# EasyEDA Pro project ProPrj_3x3motorFPGA_2025-06-10.epro, schematic FPGA
Create Date: 2025-06-04; Page Name: P1; Project Name: 3x3motorFPGA; Schematic Name: FPGA; Update Date: 2025-06-10; Company: EasyEDA.com; Page Size: A4; Version: V1.0
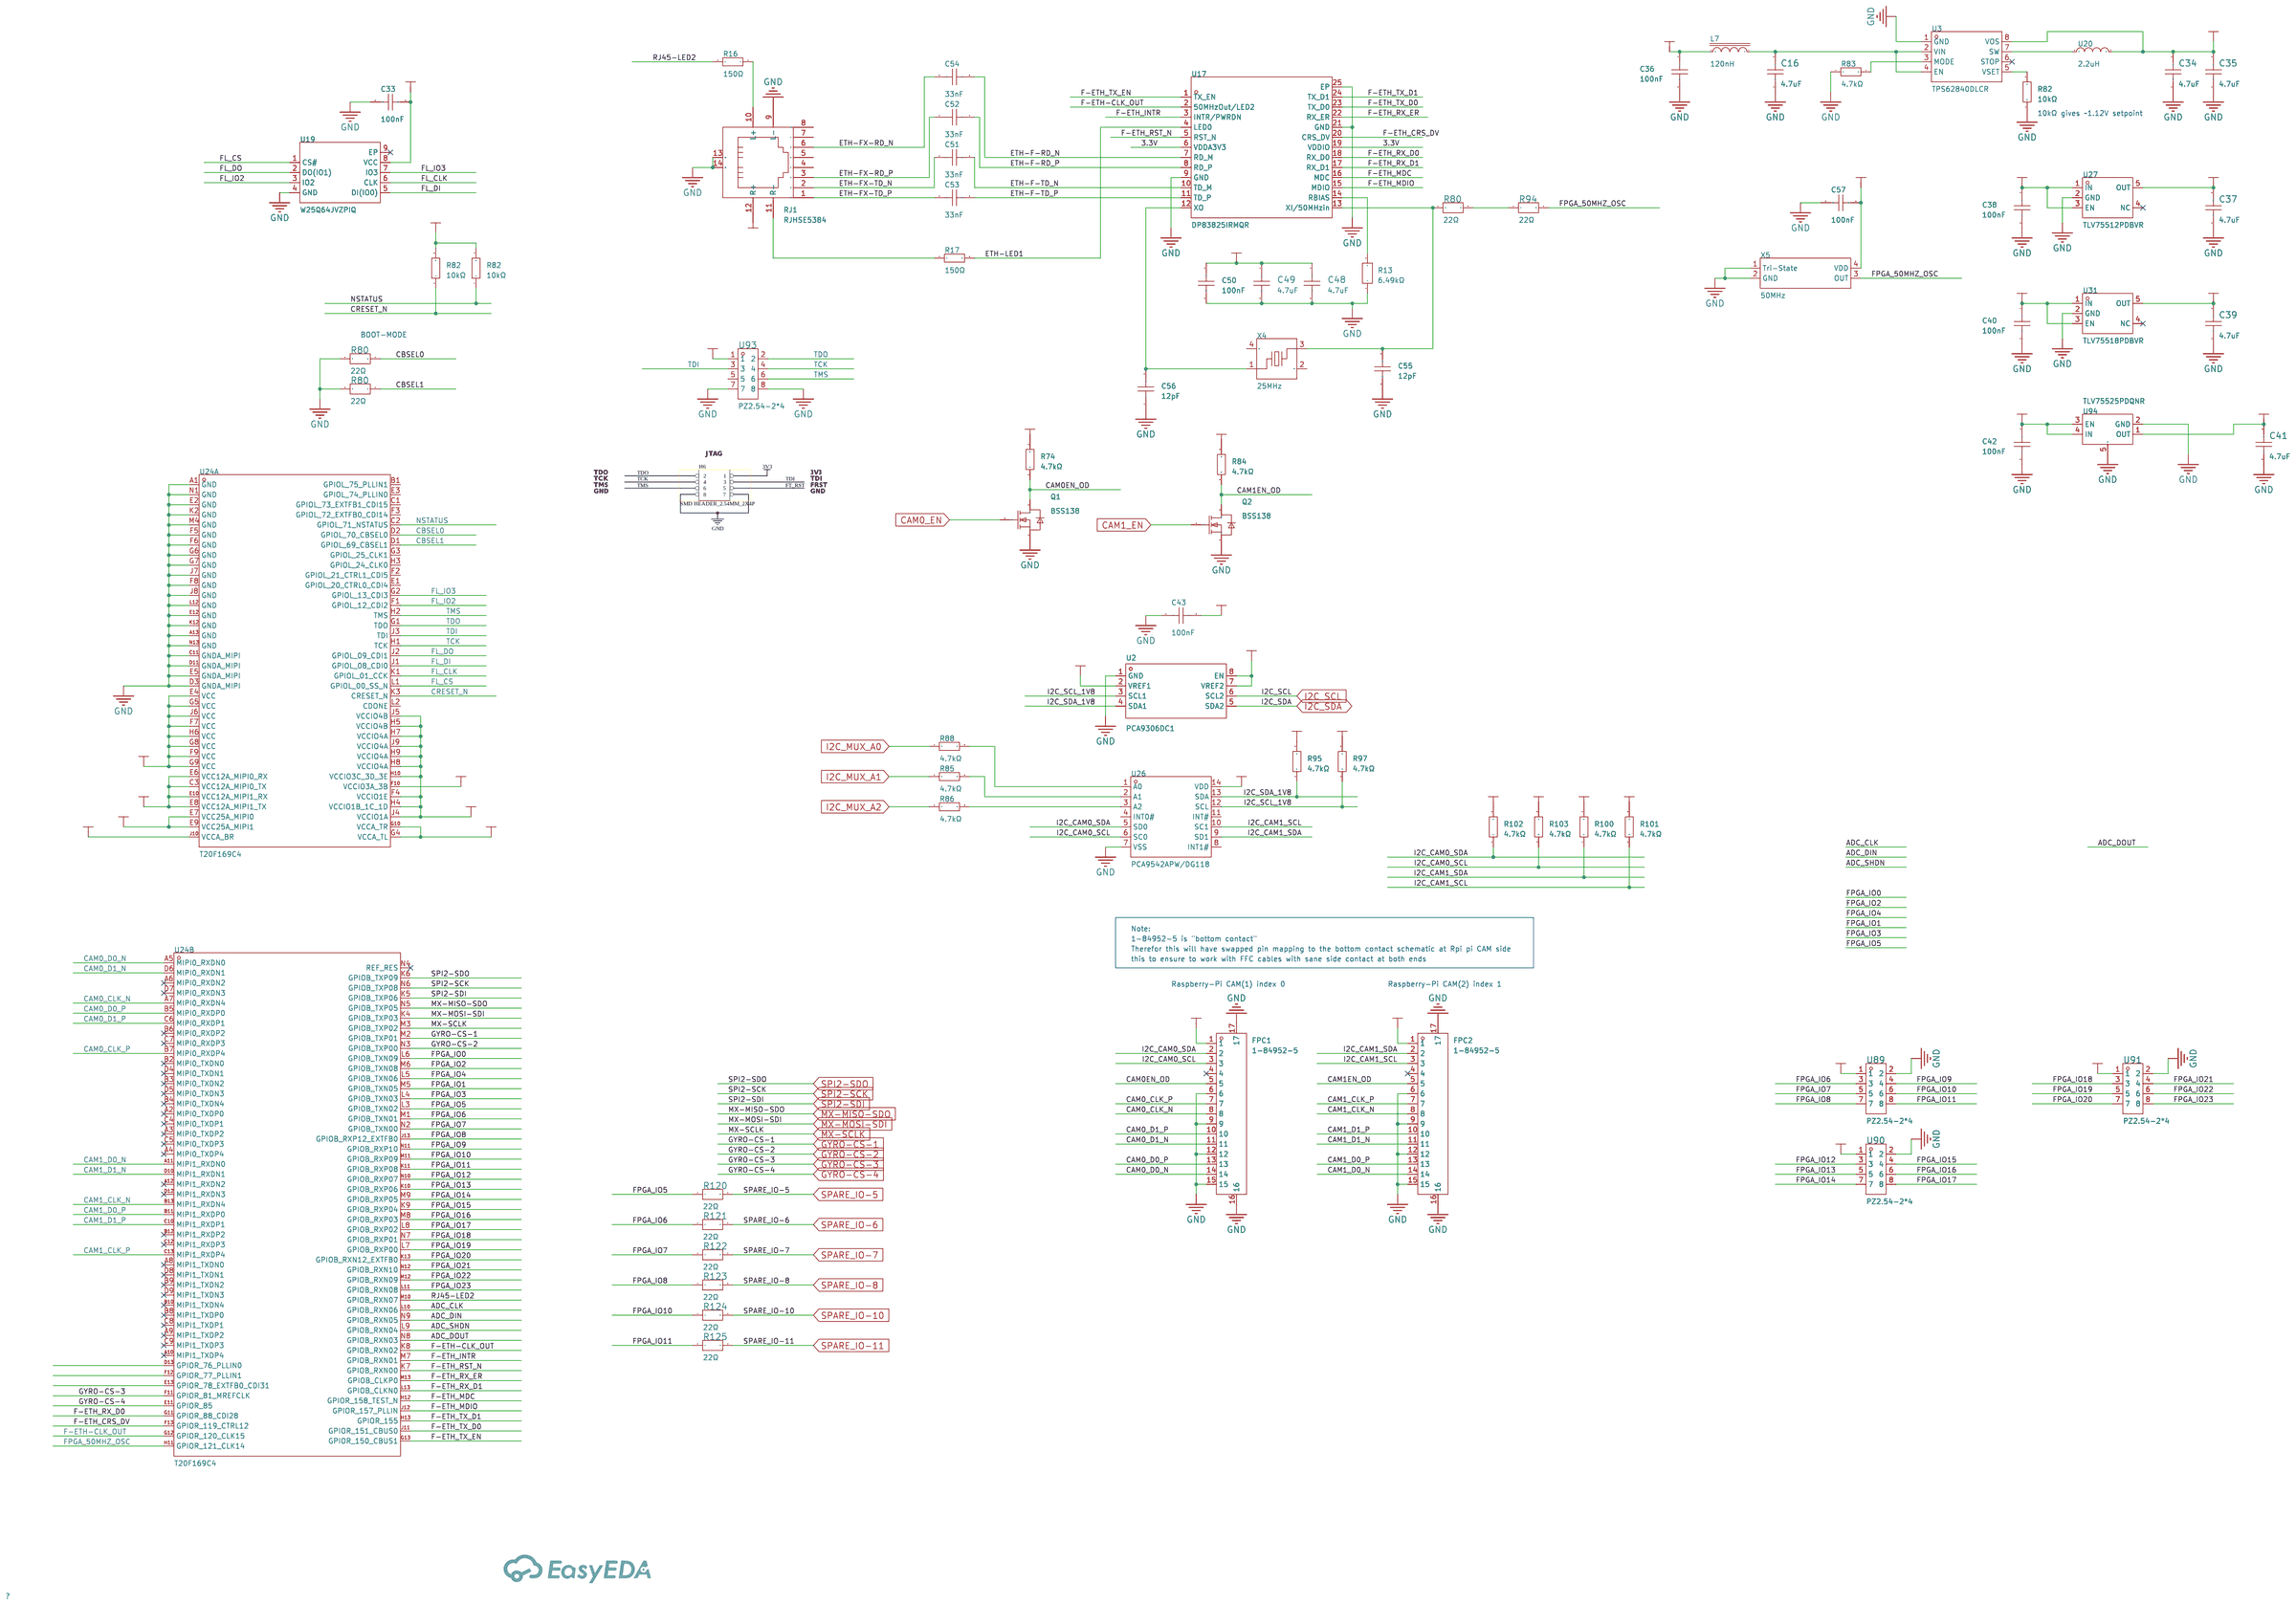
[diagram p3: schematic sheet]

## Parts
C16  4.7uF  [C0402]
C33  100nF  [C0402]
C34  4.7uF  [C0402]
C35  4.7uF  [C0402]
C36  100nF  [C0402]
C37  4.7uF  [C0402]
C38  100nF  [C0402]
C39  4.7uF  [C0402]
C40  100nF  [C0402]
C41  4.7uF  [C0402]
C42  100nF  [C0402]
C43  100nF  [C0402]
C48  4.7uF  [C0402]
C49  4.7uF  [C0402]
C50  100nF  [C0402]
C51  33nF  [C0402]
C52  33nF  [C0402]
C53  33nF  [C0402]
C54  33nF  [C0402]
C55  12pF  [C0402]
C56  12pF  [C0402]
C57  100nF  [C0402]
CBB1  -
FPC1  1-84952-5  [FPC-SMD_15P-P1.00_TE_1-84952-5]
FPC2  1-84952-5  [FPC-SMD_15P-P1.00_TE_1-84952-5]
L7  120nH  [IND-SMD_L2.9-W2.5]
Q1  BSS138  [SOT-23-3_L2.9-W1.3-P1.90-LS2.4-BR-1]
Q2  BSS138  [SOT-23-3_L2.9-W1.3-P1.90-LS2.4-BR-1]
R13  6.49kΩ  [R0402]
R16  150Ω  [R0402]
R17  150Ω  [R0402]
R74  4.7kΩ  [R0402]
R80  22Ω  [R0402]  (no BOM)
R80#2  22Ω  [R0402]
R80#3  22Ω  [R0402]
R82  10kΩ  [R0402]
R82#2  10kΩ  [R0402]
R82#3  10kΩ  [R0402]
R83  4.7kΩ  [R0402]
R84  4.7kΩ  [R0402]
R85  4.7kΩ  [R0402]
R86  4.7kΩ  [R0402]
R88  4.7kΩ  [R0402]
R94  22Ω  [R0402]  (no BOM)
R95  4.7kΩ  [R0402]
R97  4.7kΩ  [R0402]
R100  4.7kΩ  [R0402]
R101  4.7kΩ  [R0402]
R102  4.7kΩ  [R0402]
R103  4.7kΩ  [R0402]
R120  22Ω  [R0402]
R121  22Ω  [R0402]
R122  22Ω  [R0402]
R123  22Ω  [R0402]
R124  22Ω  [R0402]
R125  22Ω  [R0402]
RJ1  RJHSE5384  [RJ45-TH_RJHSE5384]
U2  PCA9306DC1  [VSSOP-8_L2.4-W2.1-P0.50-LS3.2-BR]
U3  TPS62840DLCR  [VSON-8_L2.0-W1.5-P0.50-BL]
U17  DP83825IRMQR  [HVQFN-24_L3.0-W3.0-P0.40-TL-EP1.9]
U19  W25Q64JVZPIQ  [WSON-8_L6.0-W5.0-P1.27-BL-EP]
U20  2.2uH  [IND-SMD_L4.7-W4.2]
U24  T20F169C4  [FBGA-169_L9.0-W9.0-R13-C13-P0.65-TL]  (sections 1,2)
U26  PCA9542APW/DG118  [TSSOP-14_L4.9-W4.4-P0.65-LS6.4-BL]
U27  TLV75512PDBVR  [SOT-23-5_L2.9-W1.6-P0.95-LS2.8-BR]
U31  TLV75518PDBVR  [SOT-23-5_L2.9-W1.6-P0.95-LS2.8-BR]
U89  PZ2.54-2*4  [HDR-TH_8P-P2.54-V-M-R2-C4-S2.54]
U90  PZ2.54-2*4  [HDR-TH_8P-P2.54-V-M-R2-C4-S2.54]
U91  PZ2.54-2*4  [HDR-TH_8P-P2.54-V-M-R2-C4-S2.54]
U93  PZ2.54-2*4  [HDR-TH_8P-P2.54-V-M-R2-C4-S2.54]
U94  TLV75525PDQNR  [X2SON-4_L1.0-W1.0-P0.65-TL-EP]
X4  25MHz  [CRYSTAL-SMD_4P-L5.0-W3.2-BL]
X5  50MHz  [OSC-SMD_4P-L3.2-W2.5-BL-OXETDLJANF-0.032768MHZ]

## Library data of the parts
C16 C34 C35 C37 C39 C41 C48 C49 = LMK105BBJ475MVLF: Capacitance: Tolerance:±20% Tolerance:±20% Voltage Rated: Temperature Coefficient:; LCSC Part Name: 4.7uF ±20% 10V; Supplier Part: C386043; Manufacturer: TAIYO YUDEN(太诱); Supplier Footprint: 0402; JLCPCB Part Class: Extended Part; Datasheet: https://atta.szlcsc.com/upload/public/pdf/source/20210525/C2802164_C0429B055888A674C3F00BA74B841C5B.pdf; Supplier: LCSC; Tolerance: ±20%; Check: true
C33 C36 C38 C40 C42 C43 C50 C57 = CL05B104KB54PNC: Capacitance: Tolerance:±10% Tolerance:±10% Voltage Rated: Temperature Coefficient:; LCSC Part Name: 100nF ±10% 50V; Supplier Part: C307331; Manufacturer: SAMSUNG(三星); Supplier Footprint: 0402; JLCPCB Part Class: Basic Part; Datasheet: https://atta.szlcsc.com/upload/public/pdf/source/20160218/1457707763339.pdf; Supplier: LCSC; Tolerance: ±10%; Check: true
C51-C54 = 0402B333K160CT: Capacitance: Tolerance:±10% Tolerance:±10% Voltage Rated: Temperature Coefficient:; LCSC Part Name: 33nF ±10% 16V; Supplier Part: C301939; Manufacturer: Walsin(华新科); Supplier Footprint: 0402; JLCPCB Part Class: Extended Part; Datasheet: https://atta.szlcsc.com/upload/public/pdf/source/20191217/C469650_84AD5C6F618CF4AC0C6D987F2E8FE6F8.pdf; Supplier: LCSC; Tolerance: ±10%; Check: true
C55 C56 = V120J0402HQC500NBT: Capacitance:12pF Voltage Rating:50V Temperature Coefficient:C0G; LCSC Part Name: ±5pF 12pF 50V; Supplier Part: C5251212; Manufacturer: VIIYONG(微容); Supplier Footprint: 0402; JLCPCB Part Class: Extended Part; Datasheet: https://atta.szlcsc.com/upload/public/pdf/source/20210621/C2841456_D184B2C3CE76695828CADF567D00C122.pdf; Supplier: LCSC; Voltage Rating: 50V; Temperature Coefficient: C0G; Check: true
FPC1 FPC2 = 1-84952-5_C3170098: Locking Feature:Drawer Type Contact Type:Bottom Contact Number of Contacts:15P Pitch:1mm Mounting Type:Horizontal attachment FFC, FCB Thickness:0.3mm FFC, FCB Thickness:0.3mm Height Above Board:2.56mm Contact Material:Phosphor Bronze Contact Plating:Tin O; LCSC Part Name: 间距:1mm P数:15P 抽屉式 下接; Supplier Part: C3170098; Manufacturer: TE Connectivity(泰科电子); Supplier Footprint: SMD,P=1mm,卧贴; JLCPCB Part Class: Extended Part; Datasheet: https://atta.szlcsc.com/upload/public/pdf/source/20241023/74E0AF1B1DB8D7A45038BB5AC79B3184.pdf; Supplier: LCSC; Locking Feature: Drawer Type; Contact Type: Bottom Contact; Number of Contacts: 15P; Pitch: 1mm; Mounting Type: Horizontal attachment; FFC, FCB Thickness: 0.3mm; Height Above Board: 2.56mm; Contact Material: Phosphor Bronze; Contact Plating: Tin; Operating Temperature Range: -40℃~+85℃
L7 = LSF1008-R12J-T: Inductance: Tolerance:±5% Tolerance:±5% Rated Current: DC Resistance (DCR):; LCSC Part Name: 120nH ±5%; Supplier Part: C252036; Manufacturer: EMTEK(兆欣); Supplier Footprint: 1008; JLCPCB Part Class: Extended Part; Datasheet: https://atta.szlcsc.com/upload/public/pdf/source/20180820/C252039_93C7C0847C63F47FE7E3FF4F1F6863C7.pdf; Supplier: LCSC; Tolerance: ±5%
Q1 Q2 = BSS138: Type:1 N-channel Drain Source Voltage (Vdss): Continuous Drain Current (Id): Drain Source On Resistance (RDS(on)@Vgs,Id):3.5Ω@4.5V,220mA Power Dissipation (Pd): Gate Threshold Voltage (Vgs(th)@Id):1.6V@1mA Total Gate Charge (Qg@Vgs):- Input Capacitance (C; LCSC Part Name: N沟道,电流:220mA,耐压:50V; Supplier Part: C3015220; Manufacturer: KUU; Supplier Footprint: SOT-23; JLCPCB Part Class: Extended Part; Datasheet: https://atta.szlcsc.com/upload/public/pdf/source/20220516/125DEF07DB3AB32C02C9AD402DEFFF8E.pdf; Supplier: LCSC; Type: 1 N-channel; Drain Source On Resistance (RDS(on)@Vgs,Id): 3.5Ω@4.5V,220mA; Gate Threshold Voltage (Vgs(th)@Id): 1.6V@1mA; Input Capacitance (Ciss@Vds): 50pF@25V; Operating Temperature: -55℃~+150℃
R13 = RT0402BRE076K49L: Type:Thin Film Resistor Resistance: Tolerance:±0.1% Tolerance:±0.1% Power(Watts): Temperature Coefficient:±50ppm/℃ Temperature Coefficient:±50ppm/℃ Operating Temperature Range:-55℃~+155℃ Operating Temperature Range:-55℃~+155℃; LCSC Part Name: 薄膜电阻 6.49kΩ ±0.1% 62.5mW; Supplier Part: C853380; Manufacturer: YAGEO(国巨); Supplier Footprint: 0402; JLCPCB Part Class: Extended Part; Datasheet: https://atta.szlcsc.com/upload/public/pdf/source/20200610/C326738_5639A9F1B6EB6E4AE2197577D3456E7F.pdf; Supplier: LCSC; Type: Thin Film Resistor; Tolerance: ±0.1%; Temperature Coefficient: ±50ppm/℃; Operating Temperature Range: -55℃~+155℃; Check: true
R16 R17 = 0402WGF1500TCE: Type:Thick Film Resistors Resistance: Tolerance:±1% Tolerance:±1% Power(Watts): Overload Voltage (Max): Temperature Coefficient:±100ppm/℃ Temperature Coefficient:±100ppm/℃ Operating Temperature Range:-55℃~+155℃ Operating Temperature Range:-55℃~+155℃; LCSC Part Name: 150Ω ±1% 62.5mW 厚膜电阻; Supplier Part: C25082; Manufacturer: UNI-ROYAL(厚声); Supplier Footprint: 0402; JLCPCB Part Class: Extended Part; Datasheet: https://atta.szlcsc.com/upload/public/pdf/source/20200306/C422600_1E6D84923E4A46A82E41ADD87F860B5C.pdf; Supplier: LCSC; Type: Thick Film Resistors; Tolerance: ±1%; Temperature Coefficient: ±100ppm/℃; Operating Temperature Range: -55℃~+155℃; Check: true
R74 R83-R86 R88 R95 R97 R100-R103 = 0402WGF4701TCE: Type:Thick Film Resistors Resistance:4.7kΩ Tolerance:±1% Tolerance:±1% Power(Watts): Overload Voltage (Max): Temperature Coefficient:±100ppm/℃ Temperature Coefficient:±100ppm/℃ Operating Temperature Range:-55℃~+155℃ Operating Temperature Range:-55℃~+155℃; LCSC Part Name: 4.7kΩ ±1% 62.5mW 厚膜电阻; Supplier Part: C25900; Manufacturer: UNI-ROYAL(厚声); Supplier Footprint: 0402; JLCPCB Part Class: Basic Part; Datasheet: https://atta.szlcsc.com/upload/public/pdf/source/20200306/C422600_1E6D84923E4A46A82E41ADD87F860B5C.pdf; Supplier: LCSC; Type: Thick Film Resistors; Tolerance: ±1%; Temperature Coefficient: ±100ppm/℃; Operating Temperature Range: -55℃~+155℃
R80 R80#2 R80#3 R94 R120-R125 = ERJU02J220X: Type:Thick Film Resistors Resistance: Tolerance:±5% Tolerance:±5% Power(Watts): Overload Voltage (Max):- Temperature Coefficient:±200ppm/℃ Temperature Coefficient:±200ppm/℃ Operating Temperature Range:-55℃~+155℃ Operating Temperature Range:-55℃~+155℃; LCSC Part Name: 22Ω ±5% 100mW 厚膜电阻; Supplier Part: C417075; Manufacturer: PANASONIC(松下); Supplier Footprint: 0402; JLCPCB Part Class: Extended Part; Datasheet: https://atta.szlcsc.com/upload/public/pdf/source/20190902/C417075_4E42CA60D5BEE932868E62293D93DA2D.pdf; Supplier: LCSC; Type: Thick Film Resistors; Tolerance: ±5%; Temperature Coefficient: ±200ppm/℃; Operating Temperature Range: -55℃~+155℃
R82 R82#2 R82#3 = 0402WGF1002TCE: Type:Thick Film Resistors Resistance:10kΩ Tolerance:±1% Tolerance:±1% Power(Watts): Overload Voltage (Max): Temperature Coefficient:±100ppm/℃ Temperature Coefficient:±100ppm/℃ Operating Temperature Range:-55℃~+155℃ Operating Temperature Range:-55℃~+155℃; LCSC Part Name: 10kΩ ±1% 62.5mW 厚膜电阻; Supplier Part: C25744; Manufacturer: UNI-ROYAL(厚声); Supplier Footprint: 0402; JLCPCB Part Class: Basic Part; Datasheet: https://atta.szlcsc.com/upload/public/pdf/source/20200306/C422600_1E6D84923E4A46A82E41ADD87F860B5C.pdf; Supplier: LCSC; Type: Thick Film Resistors; Tolerance: ±1%; Temperature Coefficient: ±100ppm/℃; Operating Temperature Range: -55℃~+155℃
RJ1 = RJHSE5384: Connector Type:RJ45Receptacle Number of Ports:1 Mounting Style:Right-Angle Shielding:有屏蔽 LED:WithLED Ratings:- Contact Material:Phosphor bronze Contact Plating:Gold Operating Temperature Range:-55℃~+85℃ Operating Temperature Range:-55℃~+85℃; LCSC Part Name: 弯插 带LED; Supplier Part: C464587; Manufacturer: Amphenol; Supplier Footprint: 插件; JLCPCB Part Class: Extended Part; Datasheet: https://atta.szlcsc.com/upload/public/pdf/source/20200113/C464587_DA37165506181FE3475508D68C93AFC6.pdf; Supplier: LCSC; Connector Type: RJ45Receptacle; Number of Ports: 1; Mounting Style: Right-Angle; Shielding: 有屏蔽; LED: WithLED; Contact Material: Phosphor bronze; Contact Plating: Gold; Operating Temperature Range: -55℃~+85℃
U2 = PCA9306DC1: Supplier Part: C129510; Manufacturer: NXP(恩智浦); Supplier Footprint: VSSOP-8-0.5mm; JLCPCB Part Class: Extended Part; Datasheet: https://www.nxp.com/docs/en/data-sheet/PCA9306.pdf; Supplier: LCSC
U3 = TPS62840DLCR: Function:Step-down type Output Type:Adjustable Input Voltage:1.8V~6.5V Input Voltage:1.8V~6.5V Output Voltage:1.8V~3.3V Output Voltage:1.8V~3.3V Output Current (Max):750mA Switching Frequency:1.8MHz Operating Temperature:-40℃~+125℃@(TJ) Operating Temperat; Supplier Part: C2071859; Manufacturer: TI(德州仪器); Supplier Footprint: VSON-8(1.5x2); JLCPCB Part Class: Extended Part; Datasheet: https://www.ti.com/cn/lit/gpn/tps62840; Supplier: LCSC; Function: Step-down type; Output Type: Adjustable; Input Voltage: 1.8V~6.5V; Output Voltage: 1.8V~3.3V; Output Current (Max): 750mA; Switching Frequency: 1.8MHz; Operating Temperature: -40℃~+125℃@(TJ); Synchronous Rectification: Yes; Number of Outputs: 1; Topology: Step-down; Switch tube (built-in/external): 内置
U17 = DP83825IRMQR: Application Function: Number of Channels: Interface: Supply Voltage:1.8V；3.3V Supply Voltage:1.8V；3.3V Supply Current:15.5mA Operating Temperature:-40℃~+85℃ Operating Temperature:-40℃~+85℃; LCSC Part Name: DP83825I低功耗10/100Mbps以太网物理层收发器; Supplier Part: C783599; Manufacturer: TI(德州仪器); Supplier Footprint: HVQFN-24-EP(3x3); JLCPCB Part Class: Extended Part; Datasheet: https://www.ti.com/cn/lit/gpn/dp83825i; Supplier: LCSC; Supply Voltage: 1.8V；3.3V; Supply Current: 15.5mA; Operating Temperature: -40℃~+85℃; Check: true
U19 = W25Q64JVZPIQ: Interface Type:SPI Memory Size:64Mbit Clock Frequency (fc):133MHz Supply Voltage:2.7V~3.6V Supply Voltage:2.7V~3.6V Page Programming Time (Tpp):400us Block Erase Time (tBE):120ms@(32KB) Data Retention - TDR (Year):20 years Operating Temperature:-40℃~+85℃; Supplier Part: C2940197; Manufacturer: WINBOND(华邦); Supplier Footprint: WSON-8-EP(5x6); JLCPCB Part Class: Extended Part; Datasheet: https://atta.szlcsc.com/upload/public/pdf/source/20220111/96C134BA110DAC08742B3CB6C4519B4C.pdf; Supplier: LCSC; Interface Type: SPI; Memory Size: 64Mbit; Clock Frequency (fc): 133MHz; Supply Voltage: 2.7V~3.6V; Page Programming Time (Tpp): 400us; Block Erase Time (tBE): 120ms@(32KB); Data Retention - TDR (Year): 20 years; Operating Temperature: -40℃~+85℃; Check: true
U20 = CYA0420-2.2UH: Inductance: Tolerance:±20% Tolerance:±20% Rated Current: DC Resistance (DCR):; LCSC Part Name: 2.2uH ±20%; Supplier Part: C19274348; Manufacturer: SHOU HAN(首韩); Supplier Footprint: SMD,4.7x4.2mm; JLCPCB Part Class: Extended Part; Datasheet: https://atta.szlcsc.com/upload/public/pdf/source/20231201/0D8166E166EEACA912A3B92878CE1830.pdf; Supplier: LCSC; Tolerance: ±20%
U24 = T20F169C4: Supplier Part: C485171; Manufacturer: Efinix; Supplier Footprint: BGA-169; JLCPCB Part Class: Extended Part; Datasheet: https://atta.szlcsc.com/upload/public/pdf/source/20200117/C485171_1C793653290324EFE3A704AEAD5741F9.pdf; Supplier: LCSC
U26 = PCA9542APW/DG118: Supplier Part: C3208518; Manufacturer: NXP(恩智浦); Supplier Footprint: TSSOP-14; JLCPCB Part Class: Extended Part; Datasheet: https://www.nxp.com/docs/en/data-sheet/PCA9542A.pdf; Supplier: LCSC
U27 = TLV75512PDBVR: Output Type:Fixed Maximum Input Voltage:5.5V Output Voltage:1.2V Output Voltage:1.2V Output Current:500mA Dropout Voltage:665mV@(500mA) standby current:31uA Operating Temperature:-40℃~+125℃@(Tj) Operating Temperature:-40℃~+125℃@(Tj) Output Polarity:Positi; LCSC Part Name: 具有使能功能的 500mA、高 PSRR、低 IQ、低压降稳压器; Supplier Part: C2877864; Manufacturer: TI(德州仪器); Supplier Footprint: SOT-23-5; JLCPCB Part Class: Extended Part; Datasheet: https://www.ti.com/cn/lit/gpn/tlv755p; Supplier: LCSC; Output Type: Fixed; Maximum Input Voltage: 5.5V; Output Voltage: 1.2V; Output Current: 500mA; Dropout Voltage: 665mV@(500mA); standby current: 31uA; Operating Temperature: -40℃~+125℃@(Tj); Output Polarity: Positive electrode; Number of Outputs: 1
U31 = TLV75518PDBVR: Output Type:固定 Maximum Input Voltage:5.5V Output Voltage:1.8V Output Voltage:1.8V MAX Output Current:500mA Dropout Voltage:400mV@(500mA) standby current:31uA Operating Temperature:-40℃~+125℃@(Tj) Operating Temperature:-40℃~+125℃@(Tj) Output Polarity:Posit; Supplier Part: C2877863; Manufacturer: TI(德州仪器); Supplier Footprint: SOT-23-5; JLCPCB Part Class: Extended Part; Datasheet: https://www.ti.com/cn/lit/gpn/tlv755p; Supplier: LCSC; Output Type: 固定; Maximum Input Voltage: 5.5V; Output Voltage: 1.8V; MAX Output Current: 500mA; Dropout Voltage: 400mV@(500mA); standby current: 31uA; Operating Temperature: -40℃~+125℃@(Tj); Output Polarity: Positive electrode; Number of Outputs: 1
U89-U91 U93 = PZ2.54-2*4: Pin Structure:2x4P Pitch:2.54mm Number of Rows:双排 Number of Pins:8P; Supplier Part: C5156676; Manufacturer: ZHOURI(洲日); Supplier Footprint: 插件,P=2.54mm; JLCPCB Part Class: Extended Part; Datasheet: https://atta.szlcsc.com/upload/public/pdf/source/20220923/0E7A4A94740FFD503E2D73F36F92C1EA.pdf; Supplier: LCSC; Pin Structure: 2x4P; Pitch: 2.54mm; Number of Rows: 双排; Number of Pins: 8P; Check: true
U94 = TLV75525PDQNR: LCSC Part Name: 具有使能功能的 500mA、高 PSRR、低 IQ、低压降稳压器; Supplier Part: C2876066; Manufacturer: TI(德州仪器); Supplier Footprint: X2-SON-4-EP(1x1); JLCPCB Part Class: Extended Part; Datasheet: https://www.ti.com/cn/lit/gpn/tlv755p; Supplier: LCSC
X4 = XC53M4-25.000-F12JJDT: Type:Surface Mount Crystal Frequency:25MHz Normal temperature Frequency Tolerance:±30ppm Normal temperature Frequency Tolerance:±30ppm Load Capacitance:12pF Frequency Stability:±30ppm Frequency Stability:±30ppm Equivalent Series Resistance(ESR):50Ω Operat; LCSC Part Name: 25MHz ±30ppm 12pF; Supplier Part: C2916916; Manufacturer: HCI(杭晶); Supplier Footprint: SMD5032-4P; JLCPCB Part Class: Extended Part; Datasheet: https://atta.szlcsc.com/upload/public/pdf/source/20220525/EE70191DC8EBB19615A77EA6B0DDD31A.pdf; Supplier: LCSC; Type: Surface Mount Crystal; Normal temperature Frequency Tolerance: ±30ppm; Load Capacitance: 12pF; Frequency Stability: ±30ppm; Equivalent Series Resistance(ESR): 50Ω
X5 = 2.1.3.5000023: Frequency:50MHz Normal temperature Frequency Tolerance:- Normal temperature Frequency Tolerance:- Output Type:CMOS Voltage - Supply:3.3V Voltage - Supply:3.3V Current - Supply:12mA Frequency Stability:- Frequency Stability:- Operating Temperature:-40℃~+85; LCSC Part Name: 石英晶体振荡器; Supplier Part: C42420976; Manufacturer: MDH(明德亨); Supplier Footprint: SMD3225-4P; Datasheet: https://atta.szlcsc.com/upload/public/pdf/source/20241224/B6FCB7361827EECD1E06ABD5DF4B3152.pdf; Supplier: LCSC; Output Type: CMOS; Voltage - Supply: 3.3V; Current - Supply: 12mA; Operating Temperature: -40℃~+85℃

## Nets
1.1V: C34.2 C35.2 U3.8(VOS) U20.2 U24.E4(VCC) U24.F7(VCC) U24.F9(VCC) U24.G5(VCC) U24.G8(VCC) U24.G9(VCC) U24.H6(VCC) U24.J6(VCC)
1.1VA: U24.G4(VCCA_TL) U24.G10(VCCA_TR)
1.2VA: C37.2 U24.C3(VCC12A_MIPI0_TX) U24.E6(VCC12A_MIPI0_RX) U24.E8(VCC12A_MIPI1_TX) U24.E10(VCC12A_MIPI1_RX) U27.5(OUT)
1.8V: C39.2 R95.2 R97.2 R100.2 R101.2 R102.2 R103.2 U2.2(VREF1) U24.F10(VCCIO3A_3B) U26.14(VDD) U31.5(OUT)
2.5V: C41.2 U24.E7(VCC25A_MIPI0) U24.E9(VCC25A_MIPI1) U94.1(OUT)
3.3V: C33.1 C38.1 C40.1 C42.1 C43.2 C48.1 C49.1 C50.1 C57.1 FPC1.1 FPC2.1 R74.1 R82#2.2 R82#3.2 R84.1 RJ1.12(R+) U2.7(VREF2) U2.8(EN) U17.6(VDDA3V3) U17.19(VDDIO) U19.8(VCC) U24.F4(VCCIO1E) U24.H4(VCCIO1B_1C_1D) U24.H5(VCCIO4B) U24.H7(VCCIO4A) U24.H8(VCCIO4A) U24.H9(VCCIO4A) U24.H10(VCCIO3C_3D_3E) U24.J4(VCCIO1A) U24.J5(VCCIO4B) U24.J9(VCCIO4A) U24.J10(VCCA_BR) U27.1(IN) U27.3(EN) U31.1(IN) U31.3(EN) U89.1 U90.1 U91.1 U93.1 U94.3(EN) U94.4(IN) X5.4(VDD)
5.0V: C36.1 L7.2
GND: C16.1 C33.2 C34.1 C35.1 C36.2 C37.1 C38.2 C39.1 C40.2 C41.1 C42.2 C43.1 C48.2 C49.2 C50.2 C55.1 C56.1 C57.2 FPC1.6 FPC1.9 FPC1.12 FPC1.15 FPC1.16 FPC1.17 FPC2.6 FPC2.9 FPC2.12 FPC2.15 FPC2.16 FPC2.17 Q1.2(S) Q2.2(S) R13.1 R80#2.2 R80#3.2 R82.1 R83.1 RJ1.9(L-) RJ1.13(SHELL) RJ1.14(SHELL) U2.1(GND) U3.1(GND) U17.9(GND) U17.21(GND) U17.25(EP) U19.4(GND) U24.A1(GND) U24.A13(GND) U24.C11(GNDA_MIPI) U24.D3(GNDA_MIPI) U24.D11(GNDA_MIPI) U24.E2(GND) U24.E5(GNDA_MIPI) U24.E12(GND) U24.F5(GND) U24.F6(GND) U24.F8(GND) U24.G6(GND) U24.G7(GND) U24.J7(GND) U24.J8(GND) U24.K2(GND) U24.K12(GND) U24.L12(GND) U24.M4(GND) U24.N1(GND) U24.N13(GND) U26.7(VSS) U27.2(GND) U31.2(GND) U89.2 U90.2 U91.2 U93.7 U93.8 U94.2(GND) U94.5(EP) X5.1(Tri-State) X5.2(GND)
ADC_CLK: CBB1.(FPGA_IO5) R120.1 U24.L3(GPIOB_TXN02) U24.L4(GPIOB_TXN03) U24.L5(GPIOB_TXN06) U24.L6(GPIOB_TXN09) U24.L9(GPIOB_RXN04) U24.L10(GPIOB_RXN06) U24.M5(GPIOB_TXN05) U24.M6(GPIOB_TXN08) U24.N8(GPIOB_RXN03) U24.N9(GPIOB_RXN05)
CAM0_CLK_N: FPC1.8 U24.A7(MIPI0_RXDN4)
CAM0_CLK_P: FPC1.7 U24.B7(MIPI0_RXDP4)
CAM0_D0_N: FPC1.14 U24.A5(MIPI0_RXDN0)
CAM0_D0_P: FPC1.13 U24.B5(MIPI0_RXDP0)
CAM0_D1_N: FPC1.11 U24.D6(MIPI0_RXDN1)
CAM0_D1_P: FPC1.10 U24.C6(MIPI0_RXDP1)
CAM0_EN: Q1.1(G)
CAM0EN_OD: FPC1.5 Q1.3(D) R74.2
CAM1_CLK_N: FPC2.8 U24.B13(MIPI1_RXDN4)
CAM1_CLK_P: FPC2.7 U24.C13(MIPI1_RXDP4)
CAM1_D0_N: FPC2.14 U24.A11(MIPI1_RXDN0)
CAM1_D0_P: FPC2.13 U24.B11(MIPI1_RXDP0)
CAM1_D1_N: FPC2.11 U24.D10(MIPI1_RXDN1)
CAM1_D1_P: FPC2.10 U24.C10(MIPI1_RXDP1)
CAM1_EN: Q2.1(G)
CAM1EN_OD: FPC2.5 Q2.3(D) R84.2
CBSEL0: R80#2.1 U24.D2(GPIOL_70_CBSEL0)
CBSEL1: R80#3.1 U24.D1(GPIOL_69_CBSEL1)
CRESET_N: R82#2.1 U24.K3(CRESET_N)
ETH-F-RD_N: C54.2 U17.7(RD_M)
ETH-F-RD_P: C52.2 U17.8(RD_P)
ETH-F-TD_N: C51.2 U17.10(TD_M)
ETH-F-TD_P: C53.2 U17.11(TD_P)
ETH-FX-RD_N: C54.1 RJ1.6
ETH-FX-RD_P: C52.1 RJ1.3
ETH-FX-TD_N: C51.1 RJ1.2
ETH-FX-TD_P: C53.1 RJ1.1
ETH-LED1: R17.2 U17.4(LED0)
F-ETH-CLK_OUT: U17.2(50MHzOut/LED2) U24.G12(GPIOR_120_CLK15) U24.K8(GPIOB_RXN02)
F-ETH_CRS_DV: U17.20(CRS_DV) U24.F13(GPIOR_119_CTRL12)
F-ETH_INTR: U17.3(INTR/PWRDN) U24.M7(GPIOB_RXN01)
F-ETH_MDC: U17.16(MDC) U24.H12(GPIOR_158_TEST_N)
F-ETH_MDIO: U17.15(MDIO) U24.J12(GPIOR_157_PLLIN)
F-ETH_RST_N: U17.5(RST_N) U24.K7(GPIOB_RXN00)
F-ETH_RX_D0: U17.18(RX_D0) U24.G11(GPIOR_88_CDI28)
F-ETH_RX_D1: U17.17(RX_D1) U24.L13(GPIOB_CLKN0)
F-ETH_RX_ER: U17.22(RX_ER) U24.M13(GPIOB_CLKP0)
F-ETH_TX_D0: U17.23(TX_D0) U24.J11(GPIOR_151_CBUS0)
F-ETH_TX_D1: U17.24(TX_D1) U24.H13(GPIOR_155)
F-ETH_TX_EN: U17.1(TX_EN) U24.G13(GPIOR_150_CBUS1)
FL_CLK: U19.6(CLK) U24.K1(GPIOL_01_CCK)
FL_CS: U19.1(CS#) U24.L1(GPIOL_00_SS_N)
FL_DI: U19.5(DI(IO0)) U24.J1(GPIOL_08_CDI0)
FL_DO: U19.2(DO(IO1)) U24.J2(GPIOL_09_CDI1)
FL_IO2: U19.3(IO2) U24.F1(GPIOL_12_CDI2)
FL_IO3: U19.7(IO3) U24.G2(GPIOL_13_CDI3)
FPGA_50MHZ_OSC: R94.2 U24.H11(GPIOR_121_CLK14) X5.3(OUT)
FPGA_IO6: R121.1 U24.M1(GPIOB_TXN01) U89.3
FPGA_IO7: R122.1 U24.N2(GPIOB_TXN00) U89.5
FPGA_IO8: R123.1 U24.J13(GPIOB_RXP12_EXTFB0) U89.7
FPGA_IO9: U24.N11(GPIOB_RXP10) U89.4
FPGA_IO10: R124.1 U24.M11(GPIOB_RXP09) U89.6
FPGA_IO11: R125.1 U24.K11(GPIOB_RXP08) U89.8
FPGA_IO12: U24.N10(GPIOB_RXP07) U90.3
FPGA_IO13: U24.K10(GPIOB_RXP06) U90.5
FPGA_IO14: U24.M9(GPIOB_RXP05) U90.7
FPGA_IO15: U24.K9(GPIOB_RXP04) U90.4
FPGA_IO16: U24.M8(GPIOB_RXP03) U90.6
FPGA_IO17: U24.L8(GPIOB_RXP02) U90.8
FPGA_IO18: U24.N7(GPIOB_RXP01) U91.3
FPGA_IO19: U24.L7(GPIOB_RXP00) U91.5
FPGA_IO20: U24.K13(GPIOB_RXN12_EXTFB0) U91.7
FPGA_IO21: U24.N12(GPIOB_RXN10) U91.4
FPGA_IO22: U24.M12(GPIOB_RXN09) U91.6
FPGA_IO23: U24.L11(GPIOB_RXN08) U91.8
GYRO-CS-1: U24.M2(GPIOB_TXP01)
GYRO-CS-2: U24.N3(GPIOB_TXP00)
GYRO-CS-3: U24.F11(GPIOR_81_MREFCLK)
GYRO-CS-4: U24.E11(GPIOR_85)
I2C_CAM0_SCL: FPC1.3 R103.1 U26.6(SC0)
I2C_CAM0_SDA: FPC1.2 R102.1 U26.5(SD0)
I2C_CAM1_SCL: FPC2.3 R101.1 U26.10(SC1)
I2C_CAM1_SDA: FPC2.2 R100.1 U26.9(SD1)
I2C_MUX_A0: R88.1
I2C_MUX_A1: R85.1
I2C_MUX_A2: R86.1
I2C_SCL: U2.6(SCL2)
I2C_SCL_1V8: R97.1 U2.3(SCL1) U26.12(SCL)
I2C_SDA: U2.5(SDA2)
I2C_SDA_1V8: R95.1 U2.4(SDA1) U26.13(SDA)
MX-MISO-SDO: U24.N5(GPIOB_TXP05)
MX-MOSI-SDI: U24.K4(GPIOB_TXP03)
MX-SCLK: U24.M3(GPIOB_TXP02)
NSTATUS: R82#3.1 U24.C2(GPIOL_71_NSTATUS)
RJ45-LED2: R16.2 U24.M10(GPIOB_RXN07)
SPARE_IO-5: R120.2
SPARE_IO-6: R121.2
SPARE_IO-7: R122.2
SPARE_IO-8: R123.2
SPARE_IO-10: R124.2
SPARE_IO-11: R125.2
SPI2-SCK: U24.N6(GPIOB_TXP08)
SPI2-SDI: U24.K5(GPIOB_TXP06)
SPI2-SDO: U24.K6(GPIOB_TXP09)
TCK: U24.H1(TCK) U93.4
TDI: U24.J3(TDI) U93.3
TDO: U24.G1(TDO) U93.2
TMS: U24.H2(TMS) U93.6
Net-(C16-2): C16.2 L7.1 U3.2(VIN) U3.4(EN)
Net-(C55-2): C55.2 R80.1 U17.13(XI/50MHzin) X4.3
Net-(C56-2): C56.2 U17.12(XO) X4.1
Net-(R13-2): R13.2 U17.14(RBIAS)
Net-(R16-1): R16.1 RJ1.10(L+)
Net-(R17-1): R17.1 RJ1.11(R-)
Net-(R80-2): R80.2 R94.1
Net-(R82-2): R82.2 U3.5(VSET)
Net-(R83-2): R83.2 U3.3(MODE)
Net-(R85-2): R85.2 U26.2(A1)
Net-(R86-2): R86.2 U26.3(A2)
Net-(R88-2): R88.2 U26.1(A0)
Net-(U3-7): U3.7(SW) U20.1

Not connected (* = marked no-connect by the designer): FPC1 4*; FPC2 4*; RJ1 4 5 7 8; U3 6(STOP)*; U19 9(EP)*; U24 A2(MIPI0_TXDP0)* A3(MIPI0_TXDP2)* A4(MIPI0_TXDP4)* A6(MIPI0_RXDN2)* A8(MIPI1_TXDN0)* A9(MIPI1_TXDP2)* A10(MIPI1_TXDP4)* A12(MIPI1_RXDN2)* B1(GPIOL_75_PLLIN1) B2(MIPI0_TXDN0)* B3(MIPI0_TXDN2)* B4(MIPI0_TXDN4)* B6(MIPI0_RXDP2)* B8(MIPI1_TXDP0)* B9(MIPI1_TXDN2)* B10(MIPI1_TXDN4)* B12(MIPI1_RXDP2)* C1(GPIOL_73_EXTFB1_CDI15) C4(MIPI0_TXDP1)* C5(MIPI0_TXDP3)* C7(MIPI0_RXDP3)* C8(MIPI1_TXDP1)* C9(MIPI1_TXDP3)* C12(MIPI1_RXDP3)* D4(MIPI0_TXDN1)* D5(MIPI0_TXDN3)* D7(MIPI0_RXDN3)* D8(MIPI1_TXDN1)* D9(MIPI1_TXDN3)* D12(MIPI1_RXDN3)* D13(GPIOR_76_PLLIN0) E1(GPIOL_20_CTRL0_CDI4) E3(GPIOL_74_PLLIN0) E13(GPIOR_78_EXTFB0_CDI31) F2(GPIOL_21_CTRL1_CDI5) F3(GPIOL_72_EXTFB0_CDI14) F12(GPIOR_77_PLLIN1) G3(GPIOL_25_CLK1) H3(GPIOL_24_CLK0) L2(CDONE) N4(REF_RES)*; U26 4(INT0#) 8(INT1#) 11(INT#); U27 4(NC)*; U31 4(NC)*; U93 5; X4 2(GND) 4(GND)

## Notes on the sheet
- 10kΩ gives ~1.12V setpoint
- BOOT-MODE
- Note:
- 1-84952-5 is "bottom contact"
- Therefor this will have swapped pin mapping to the bottom contact schematic at Rpi pi CAM side
- this to ensure to work with FFC cables with sane side contact at both ends
- Raspberry-Pi CAM(1) index 0
- Raspberry-Pi CAM(2) index 1
